# EAGLE design Joystick-Minikarte (EAGLE 6.3)
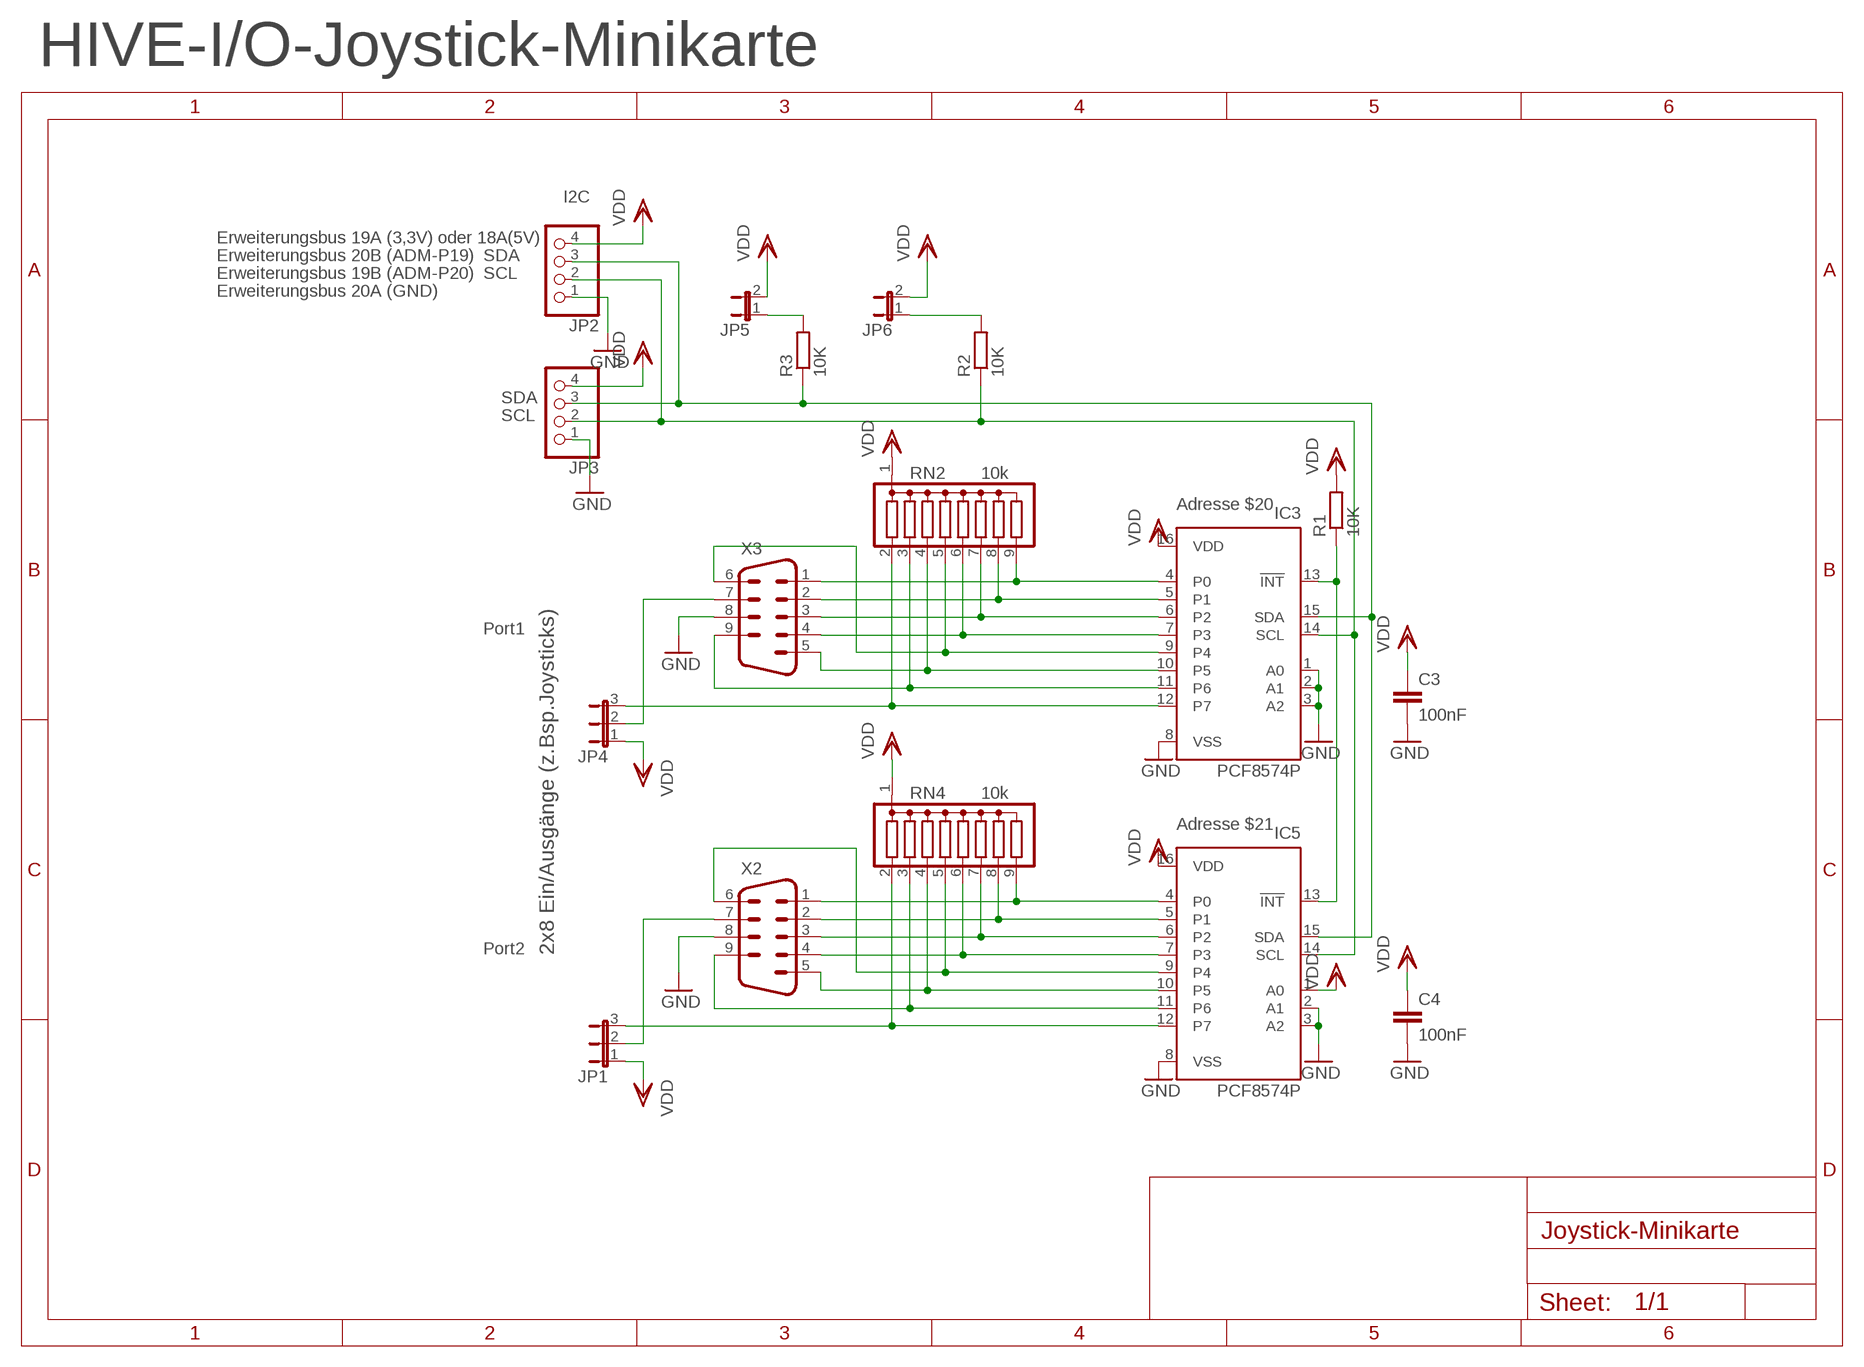
[diagram p0: schematic, sheet 1]

## Parts
C3  100nF  C-EU025-024X044  [C025-024X044]
C4  100nF  C-EU025-024X044  [C025-024X044]
IC3  PCF8574P  [DIL16]
IC5  PCF8574P  [DIL16]
JP1  JP2E  [JP2]
JP2  PINHD-1X4  [1X04]
JP3  PINHD-1X4  [1X04]
JP4  JP2E  [JP2]
JP5  JP1E  [JP1]
JP6  JP1E  [JP1]
R1  10K  R-EU_0204/7  [0204/7]
R2  10K  R-EU_0204/7  [0204/7]
R3  10K  R-EU_0204/7  [0204/7]
RN2  10k  G08R  [SIL9]
RN4  10k  G08R  [SIL9]
X2  M09HP  [M09HP]
X3  M09HP  [M09HP]

## Nets
GND [gnd]: C3.2 C4.2 IC3.1(A0) IC3.2(A1) IC3.3(A2) IC3.8(VSS) IC5.2(A1) IC5.3(A2) IC5.8(VSS) JP2.1 JP3.1 X2.8 X3.8
N$1: JP4.2 X3.7
N$2: JP1.2 X2.7
N$3: JP6.1 R2.2
N$4: JP5.1 R3.2
N$8: IC3.15(SDA) IC5.15(SDA) JP2.3 JP3.3 R3.1
N$14: IC3.14(SCL) IC5.14(SCL) JP2.2 JP3.2 R2.1
N$18: IC3.13(!INT) IC5.13(!INT) R1.1
N$22: IC5.4(P0) RN4.9 X2.1
N$23: IC5.5(P1) RN4.8 X2.2
N$24: IC5.6(P2) RN4.7 X2.3
N$25: IC5.7(P3) RN4.6 X2.4
N$26: IC5.9(P4) RN4.5 X2.6
N$27: IC5.10(P5) RN4.4 X2.5
N$28: IC5.11(P6) RN4.3 X2.9
N$29: IC5.12(P7) JP1.3 RN4.2
N$30: IC3.4(P0) RN2.9 X3.1
N$31: IC3.5(P1) RN2.8 X3.2
N$32: IC3.6(P2) RN2.7 X3.3
N$33: IC3.7(P3) RN2.6 X3.4
N$34: IC3.9(P4) RN2.5 X3.6
N$35: IC3.10(P5) RN2.4 X3.5
N$36: IC3.11(P6) RN2.3 X3.9
N$37: IC3.12(P7) JP4.3 RN2.2
VDD [supply]: C3.1 C4.1 IC3.16(VDD) IC5.1(A0) IC5.16(VDD) JP1.1 JP2.4 JP3.4 JP4.1 JP5.2 JP6.2 R1.2 RN2.1 RN4.1

## Notes on the sheet
- HIVE-I/O-Joystick-Minikarte
- I2C
- Erweiterungsbus 19A (3,3V) oder 18A(5V)
- Erweiterungsbus 20B (ADM-P19) | SDA
- Erweiterungsbus 19B (ADM-P20) | SCL
- Erweiterungsbus 20A (GND)
- SDA
- SCL
- Adresse $20
- Port1
- Adresse $21
- Port2 | 2x8 Ein/Ausgänge (z.Bsp.Joysticks)

## Library data of the parts
C3 C4 = rcl:C-EU: CAPACITOR, European symbol
IC3 IC5 = micro-philips:PCF8574: I2C-Bus Remote 8-bit I/O expander http://www.semiconductors.philips.com/acrobat_download/datasheets/PCF8574_4.pdf; MPN: PCF8574PN; OC_FARNELL: 204020; OC_NEWARK: 11N8515
JP1 JP4 = jumper:JP2E: JUMPER
JP2 JP3 = pinhead:PINHD-1X4: PIN HEADER
JP5 JP6 = jumper:JP1E: JUMPER
R1-R3 = rcl:R-EU_: RESISTOR, European symbol
RN2 RN4 = resistor-sil:G08R: SIL RESISTOR; OC_FARNELL: unknown; OC_NEWARK: unknown
X2 X3 = con-subd:M09: SUB-D; OC_FARNELL: unknown; OC_NEWARK: unknown

## Net classes
1 supply: width 0.635 mm
2 gnd: width 16.129 mm
3 vdd: width 16.129 mm

## Board
Mini-Joystick-Karte gedacht für die Hive-Tastatur-Version oder direkt im Hive-Gehäuse (produziert)
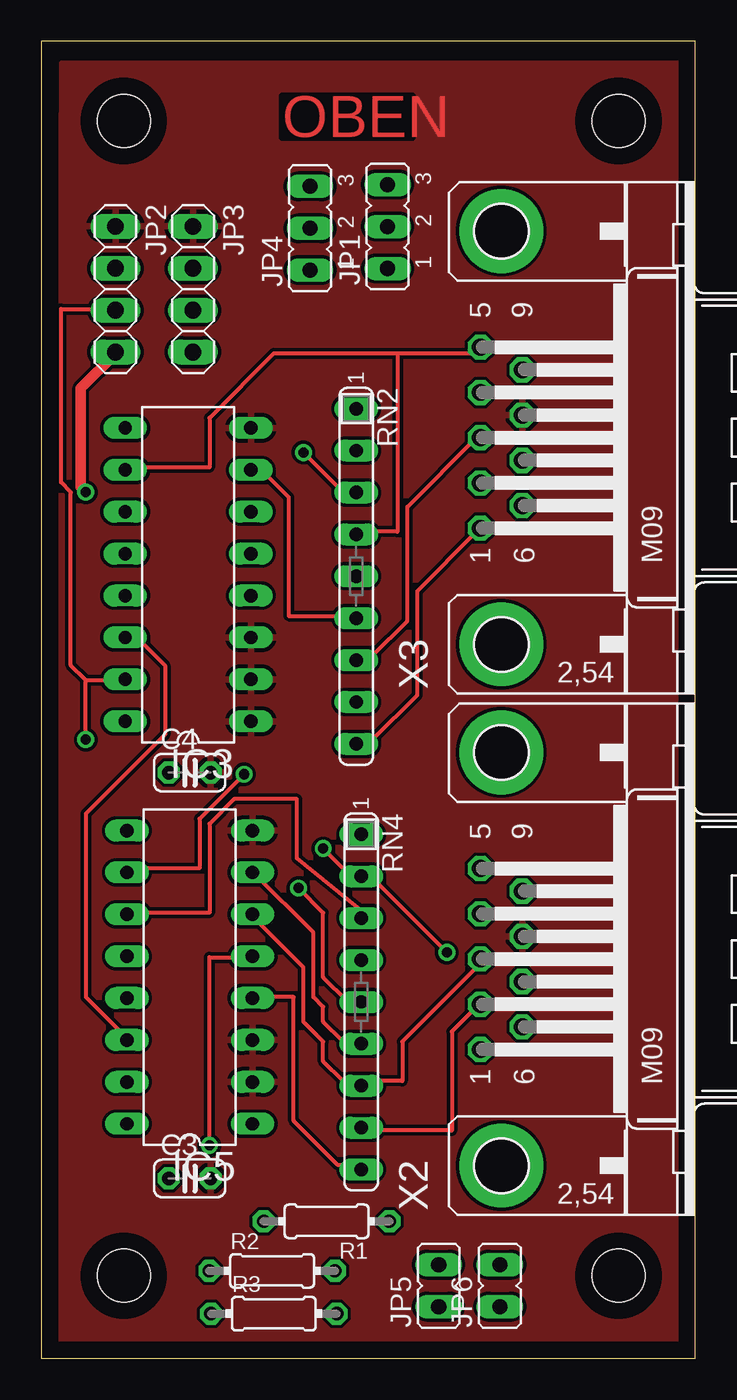
[diagram p1: board, top side]
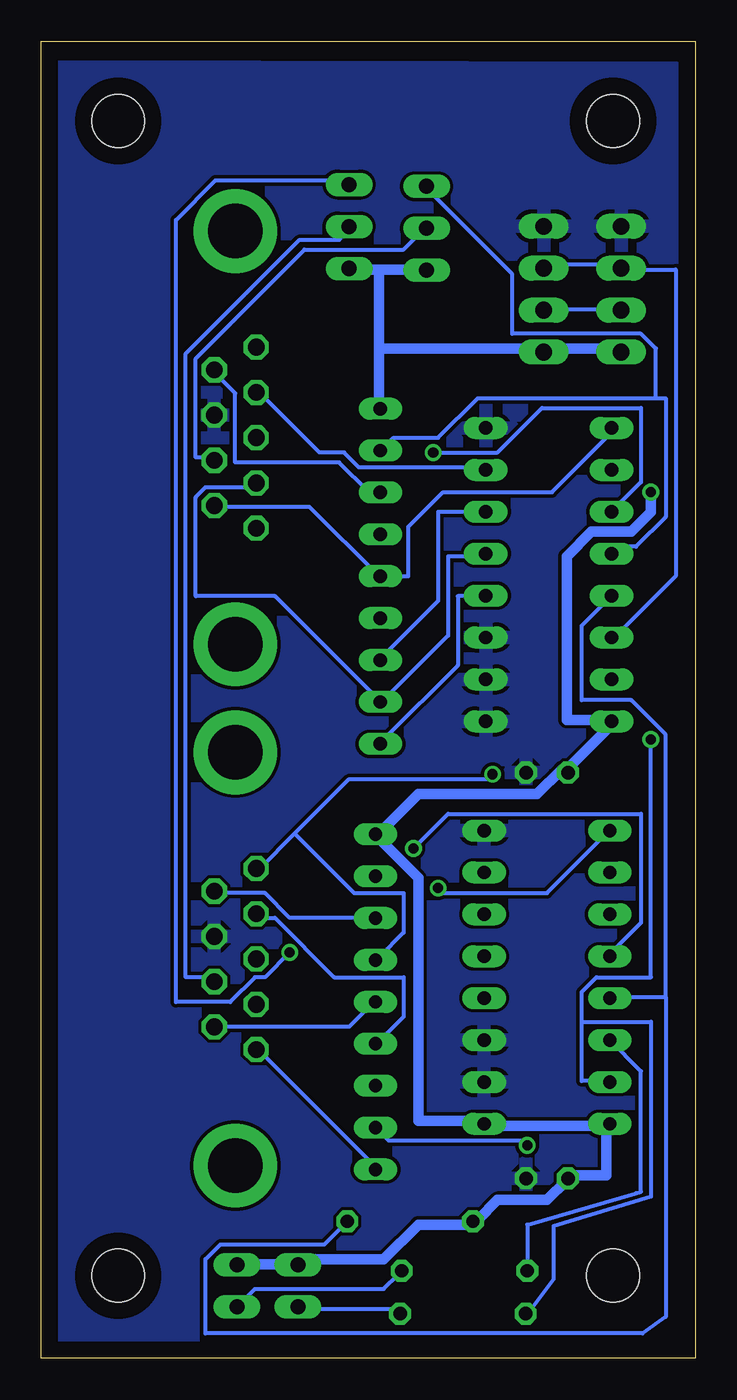
[diagram p2: board, bottom side, seen from below]

Size 39.67 x 79.83 mm. Coordinates in mm from the lower left corner, seen from the top.
Outline: 0,0 39.67,0 39.67,79.83 0,79.83 0,0
Copper layers (1*16): Top 0.035mm / dielectric 1.5mm / Bottom 0.035mm
Design rules "default": minimum track width 10mil, minimum drill 24mil, track to track 8mil, track to pad 8mil, pad to pad 8mil, via to via 8mil, smd to smd 8mil, copper to edge 40mil, drill to drill 8mil, minimum pad ring 10mil, minimum via ring 8mil, stop-mask expansion 4mil, vias tented up to drill 0mil, thermal gap 10mil
Holes 3.2 mm at 5,75 35,75 5,5 35,5

### Footprints (pad centres in the part's own frame; a part is rotated, then mirrored left to right if it is on the bottom)
C025-024X044 = drill 0.813 octagon: 1 -1.27,0; 2 1.27,0
DIL16 = drill 0.813 long: 1 -8.89,-3.81; 2 -6.35,-3.81; 3 -3.81,-3.81; 4 -1.27,-3.81; 5 1.27,-3.81; 6 3.81,-3.81; 7 6.35,-3.81; 8 8.89,-3.81; 9 8.89,3.81; 10 6.35,3.81; 11 3.81,3.81; 12 1.27,3.81; 13 -1.27,3.81; 14 -3.81,3.81; 15 -6.35,3.81; 16 -8.89,3.81
JP2 = drill 0.914 long: 1 -2.54,0; 2 0,0; 3 2.54,0
1X04 = drill 1.016 long: 1 -3.81,0; 2 -1.27,0; 3 1.27,0; 4 3.81,0
JP1 = drill 0.914 long: 1 0,-1.27; 2 0,1.27
0204/7 = drill 0.813 octagon: 1 -3.81,0; 2 3.81,0
SIL9 = drill 0.813 long: 1 -10.16,0; 2 -7.62,0; 3 -5.08,0; 4 -2.54,0; 5 0,0; 6 2.54,0; 7 5.08,0; 8 7.62,0; 9 10.16,0
M09HP = drill 1.016 octagon: 1 -5.486,1.27; 2 -2.743,1.27; 3 0,1.27; 4 2.743,1.27; 5 5.486,1.27; 6 -4.115,-1.27; 7 -1.372,-1.27; 8 1.372,-1.27; 9 4.115,-1.27 | drill 3.302 pad 5.08: G1 -12.522,0; G2 12.522,0

### Placement (x,y rotation side)
C3  9,10.9 0 top
C4  9,35.5 0 top
IC3  8.9,47.5 90 top
IC5  9,23.1 90 top
JP1  21,68.6 90 top
JP2  4.5,64.8 270 top
JP3  9.2,64.8 270 top
JP4  16.3,68.5 90 top
JP5  24.1,4.4 0 top
JP6  27.8,4.4 0 top
R1  17.3,8.3 180 top
R2  14,5.3 0 top
R3  14.1,2.7 0 top
RN2  19.1,47.4 270 top
RN4  19.4,21.6 270 top
X2  27.9,24.2 90 top
X3  27.9,55.8 90 top

### Tracks (layer width: path | path; a pad name or v marks a point on that pad's centre or on a via)
GND
  pour Bottom: 1.2,78.2 38.95,78.3 39.45,0.7 1.1,0.7
  pour Top: 1.27,78.49 39.21,78.46 39.41,0.5 0.87,0.62
N$1
  Bottom 0.254: JP4.2 16.5,68.4 17.7,67.2 23.7,67.2 30.3,60.6 30.3,54.6 29.4,54.6 X3.7
N$2
  Bottom 0.254: JP1.2 21,68.4 21.6,67.8 24,67.8 30.9,60.9 30.9,23.1 29.4,23.1 X2.7
N$3
  Bottom 0.254: R2.2 18,5.1 18.9,4.2 26.7,4.2 27.6,3.3 JP6.1
N$4
  Bottom 0.254: R3.2 18,2.7 18.3,3 24,3 JP5.1
N$8  (via drill 0.61)
  Top 0.254: 2.7,41.1 4.8,41.1 IC3.15 | v2.7,37.5 2.7,41.1 | 2.7,41.1 1.8,42 1.8,52.5 1.2,53.1 1.2,63.6 4.5,63.6 JP2.3
  Bottom 0.254: JP2.3 4.5,63.6 9,63.6 JP3.3 | v2.7,37.5 2.7,23.1 6,23.1 6.9,22.2 6.9,20.4 | 6.9,20.4 6.9,16.8 5.4,16.8 IC5.15 | 6.9,20.4 2.7,20.4 2.7,9.8 8.6,8 8.6,4.8 10.2,2.7 R3.1
N$14
  Top 0.254: IC5.14 5.1,19.5 2.7,21.9 2.7,33 7.5,37.8 7.5,42 6,43.5 5.1,43.5 IC3.14
  Bottom 0.254: IC5.14 3.3,17.4 3.3,10.1 3.6,10 10.2,8.1 R2.1 | IC3.14 4.8,43.8 1.2,47.4 1.2,66 4.5,66 JP2.2 4.5,66.3 9,66.3 JP3.2
N$18
  Bottom 0.254: 1.8,21.9 1.8,37.8 3.9,39.9 6.9,39.9 6.9,44.4 5.1,46.2 IC3.13 | 1.8,21.9 5.1,21.9 IC5.13 | 1.8,21.9 1.8,2.5 3.2,1.5 29.7,1.5 29.7,6 28.8,6.9 22.5,6.9 21.3,8.1 R1.1
N$22
  Top 0.254: IC5.4 12.9,21.9 15.3,21.9 15.3,14.4 18,11.7 19.2,11.7 RN4.9
  Bottom 0.254: RN4.9 19.5,11.7 26.4,18.6 X2.1
N$23  (via drill 0.61)
  Top 0.254: RN4.8 19.5,13.8 24.9,13.8 24.9,19.8 26.4,21.3 X2.2 | v10.2,12.9 10.2,24.3 12.6,24.3 IC5.5
  Bottom 0.254: v10.2,12.9 10.5,13.2 18.6,13.2 19.2,13.8 RN4.8
N$24
  Top 0.254: X2.3 26.4,24 26.4,23.7 21.9,19.2 21.9,16.8 19.5,16.8 RN4.7 19.2,16.8 18.3,16.8 17.1,18 17.1,19.2 15.9,20.4 15.9,23.7 12.9,26.7 IC5.6
N$25
  Top 0.254: IC5.7 12.9,29.4 16.5,25.8 16.5,21.9 17.1,21.3 17.1,20.4 18.3,19.2 19.2,19.2 RN4.6
  Bottom 0.254: RN4.6 19.2,19.2 17.7,20.7 17.7,23.1 21.9,23.1 25.5,26.7 26.4,26.7 X2.4
N$26  (via drill 0.61)
  Top 0.254: v15.6,28.5 17.1,27 17.1,23.1 18.6,21.6 RN4.5
  Bottom 0.254: v15.6,28.5 15.3,28.2 9,28.2 5.4,31.8 IC5.9 | X2.6 29.1,20.1 21,20.1 19.5,21.6 RN4.5
N$27  (via drill 0.61)
  Top 0.254: v12.3,35.4 9.6,32.7 9.6,29.7 5.4,29.7 IC5.10
  Bottom 0.254: v12.3,35.4 12.6,35.1 21,35.1 24.3,31.8 | 24.3,31.8 26.4,29.7 X2.5 | 24.3,31.8 20.7,28.2 17.7,28.2 17.7,25.8 19.2,24.3 RN4.4
N$28
  Top 0.254: IC5.11 5.4,27 10.2,27 10.2,32.4 11.7,33.9 15.5,33.9 15.5,30.3 19.2,27.3 19.2,26.7 RN4.3
  Bottom 0.254: X2.9 29.1,28.2 26.1,28.2 24.6,26.7 19.5,26.7 RN4.3
N$29  (via drill 0.61)
  Top 0.254: v17.1,30.9 18.6,29.4 19.2,29.4 RN4.2 19.5,29.1 20.1,29.1 v24.6,24.6
  Bottom 0.254: v17.1,30.9 15,33 3.3,33 3.3,26.4 5.1,24.6 IC5.12 | v24.6,24.6 26.1,23.1 26.7,23.1 28.2,21.6 31.5,21.6 31.5,69 29.1,71.4 21,71.4 JP1.3
N$30
  Top 0.254: X3.1 26.4,50.1 22.8,46.5 22.8,40.2 20.1,37.5 19.2,37.5 RN2.9
  Bottom 0.254: RN2.9 18.9,37.5 14.4,42 14.4,46.2 12.9,46.2 IC3.4
N$31
  Bottom 0.254: IC3.5 12.9,48.6 15,48.6 15,43.8 18.9,39.9 RN2.8 19.2,39.9 25.5,46.2 30.3,46.2 30.3,52.2 29.7,52.8 26.7,52.8 X3.2
N$32
  Top 0.254: X3.3 26.4,55.8 22.2,51.6 22.2,44.7 20.1,42.6 19.2,42.6 RN2.7
  Bottom 0.254: RN2.7 18.9,42.6 15.6,45.9 15.6,51.3 12.9,51.3 IC3.6
N$33
  Top 0.254: RN2.6 18.9,45 15,45 15,52.2 13.5,53.7 12.9,53.7 IC3.7
  Bottom 0.254: X3.4 26.4,58.5 22.8,54.9 21.3,54.9 20.4,54 12.9,54 IC3.7
N$34
  Bottom 0.254: IC3.9 5.1,56.1 8.7,52.5 15.3,52.5 17.4,50.4 17.4,47.4 RN2.5 19.2,47.4 23.4,51.6 29.1,51.6 X3.6
N$35
  Top 0.254: 21.6,60.9 26.4,60.9 26.4,61.2 X3.5 | 21.6,60.9 14.1,60.9 10.2,57 10.2,54 5.1,54 IC3.10 | 21.6,60.9 21.6,50.1 19.2,50.1 RN2.4
N$36  (via drill 0.61)
  Top 0.254: v15.9,54.9 18.3,52.5 18.9,52.5 RN2.3
  Bottom 0.254: IC3.11 3.3,53.1 3.3,57.6 9.3,57.6 12,54.9 v15.9,54.9 | X3.9 29.1,59.7 27.9,58.5 27.9,54.3 21.6,54.3 19.8,52.5 19.2,52.5 RN2.3
N$37
  Bottom 0.254: 2.4,58.2 13.2,58.2 15.6,55.8 18.3,55.8 18.9,55.2 RN2.2 | 2.4,58.2 1.8,58.2 1.8,51 3.6,49.2 4.5,49.2 4.8,48.9 IC3.12 | 2.4,58.2 2.4,61.2 3.3,62.1 11.1,62.1 11.1,65.7 16.2,70.8 JP4.3
VDD  (via drill 0.61)
  Top 0.635: 5.1,38.7 IC3.16 | 5.1,14.1 IC5.16 | v2.7,52.5 2.4,52.8 2.4,58.8 4.5,60.9 JP2.4
  Bottom 0.635: JP2.4 4.5,61.2 9,61.2 JP3.4 9.3,61.2 19.2,61.2 | 19.2,66 19.2,61.2 | 19.2,61.2 19.2,57.6 RN2.1 | 19.2,66 21,66 JP1.1 | 19.2,66 16.5,66 JP4.1 | JP6.2 27.6,5.7 24.3,5.7 JP5.2 24,5.7 23.7,6 18.9,6 16.8,8.1 13.5,8.1 R1.2 13.2,8.4 12,9.6 9,9.6 7.8,10.8 C3.1 7.5,11.1 5.4,11.1 5.4,14.1 IC5.16 5.7,14.1 12.6,14.1 IC5.1 12.9,14.4 16.8,14.4 16.8,29.1 19.2,31.5 RN4.1 19.2,31.8 16.8,34.2 9.6,34.2 8.1,35.7 C4.1 7.8,35.7 5.1,38.4 IC3.16 5.4,38.7 7.8,38.7 7.8,48.6 6.3,50.1 3.9,50.1 2.7,51.3 v2.7,52.5

### Text on the board
Top: OBEN